# Altium schematic sheet 原理图.SchDoc
size A4; SheetNumber: 0; SheetTotal: 0
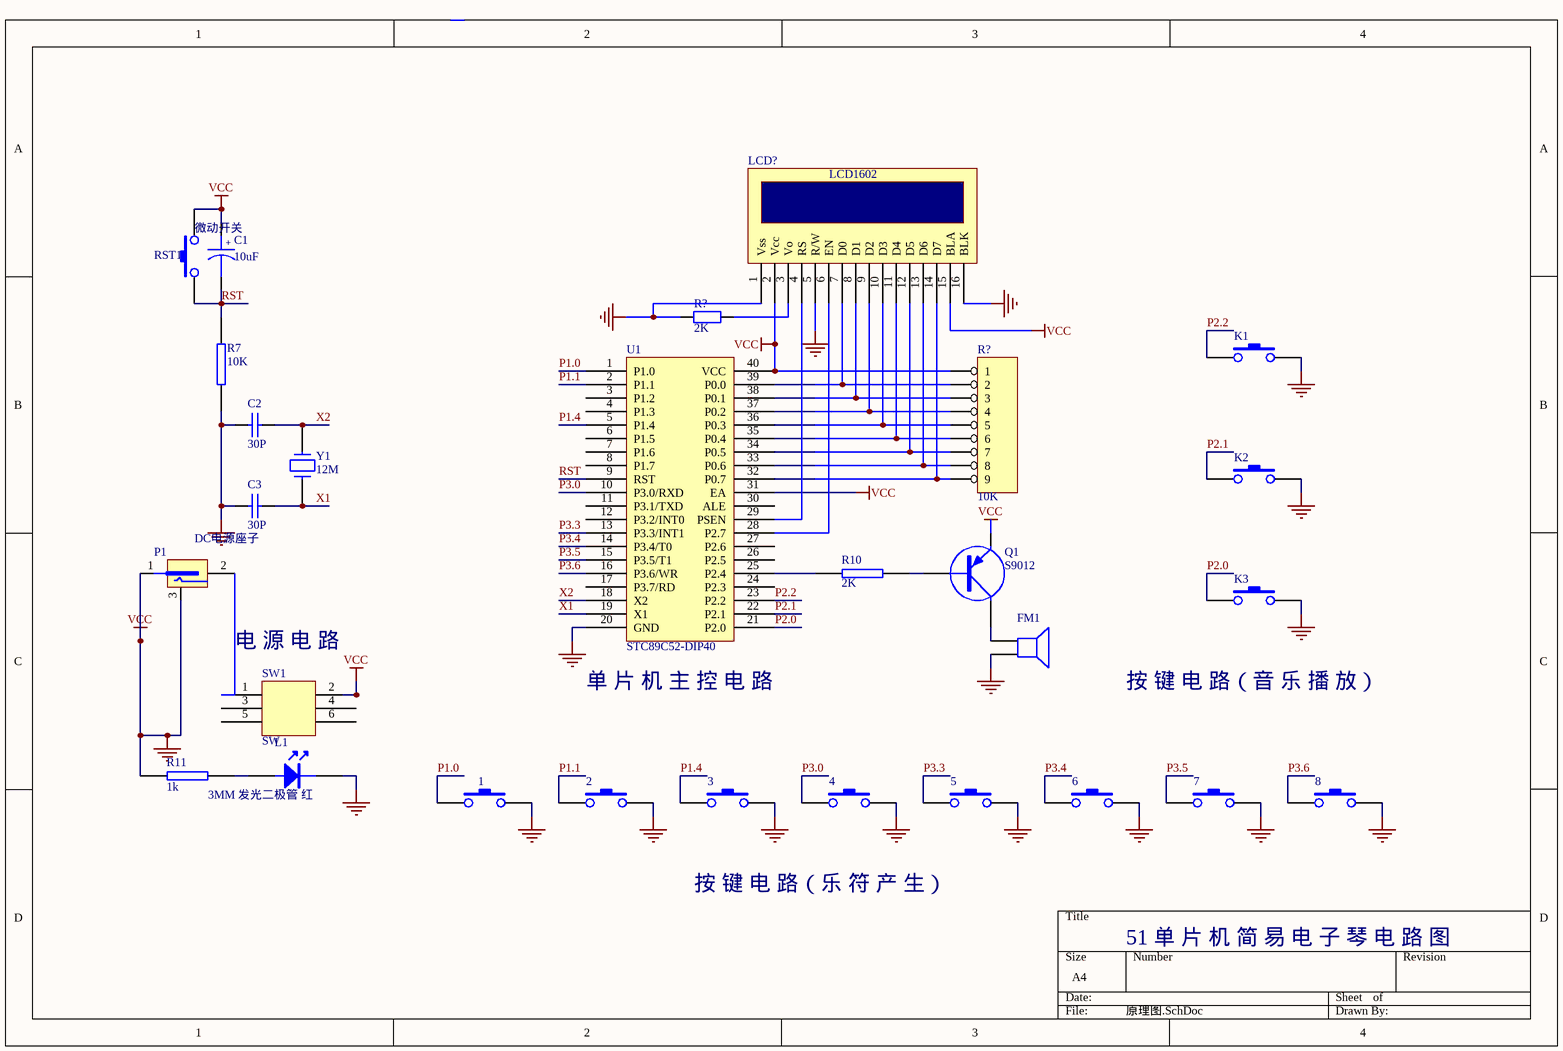
[diagram p0: 原理图.SchDoc]

## Parts
(Parts that share a designator on the sheet are numbered #1, #2 ... from top to bottom, then left to right.)
1  微动开关  [SW-PB]  (value not drawn)
2  微动开关  [SW-PB]  (value not drawn)
3  微动开关  [SW-PB]  (value not drawn)
4  微动开关  [SW-PB]  (value not drawn)
5  微动开关  [SW-PB]  (value not drawn)
6  微动开关  [SW-PB]  (value not drawn)
7  微动开关  [SW-PB]  (value not drawn)
8  微动开关  [SW-PB]  (value not drawn)
C1  10uF  [25V/4.7U]
C2  30P  [CAP-2.54]
C3  30P  [CAP-2.54]
FM1  SPEAKER  [BELL]  (value not drawn)
K1  微动开关  [SW-PB]  (value not drawn)
K2  微动开关  [SW-PB]  (value not drawn)
K3  微动开关  [SW-PB]  (value not drawn)
L1  3MM 发光二极管 红  [LED-3mm]
LCD?  LCD1602  [LCD1602]
P1  DC电源座子  [DC002]
Q1  S9012  [TO-92]
R7  10K  [AXIAL-0.4]
R10  2K  [AXIAL-0.4]
R11  1k  [AXIAL-0.4]
R?#1  2K  [AXIAL-0.4]
R?#2  10K  [SIP9]
RST1  微动开关  [SW-PB]
SW1  SW  [SW7X7]
U1  STC89C52-DIP40  [dip40]
Y1  12M  [XTAL]

## Nets
GND: 1.2 2.2 3.2 4.2 5.2 6.2 7.2 8.2 C1.1 C2.2 C3.2 FM1.2 K1.2 K2.2 K3.2 L1.2 LCD?.1(Vss) LCD?.2(Vcc) LCD?.5(R/W) LCD?.15(BLA) LCD?.16(BLK) P1.1 P1.3 Q1.2(E) R7.1 R11.1 R?#1.1 R?#2.1 RST1.2 SW1.2 U1.20(GND) U1.31(EA) U1.40(VCC)  [also labelled VCC]
P1.0: 1.1 U1.1(P1.0)
P1.1: 2.1 U1.2(P1.1)
P1.4: 3.1 U1.5(P1.4)
P2.0: K3.1 U1.21(P2.0)
P2.1: K2.1 U1.22(P2.1)
P2.2: K1.1 U1.23(P2.2)
P3.0: 4.1 U1.10(P3.0/RXD)
P3.3: 5.1 U1.13(P3.3/INT1)
P3.4: 6.1 U1.14(P3.4/T0)
P3.5: 7.1 U1.15(P3.5/T1)
P3.6: 8.1 U1.16(P3.6/WR)
RST: C1.2 R7.2 RST1.1 U1.9(RST)
X1: C3.1 U1.19(X1) Y1.1
X2: C2.1 U1.18(X2) Y1.2
NetFM1_1: FM1.1 Q1.3(C)
NetL1_1: L1.1 R11.2
NetLCD?_3: LCD?.3(Vo) R?#1.2
NetLCD?_4: LCD?.4(RS) U1.29(PSEN)
NetLCD?_6: LCD?.6(EN) U1.28(P2.7)
NetLCD?_7: LCD?.7(D0) R?#2.2 U1.39(P0.0)
NetLCD?_8: LCD?.8(D1) R?#2.3 U1.38(P0.1)
NetLCD?_9: LCD?.9(D2) R?#2.4 U1.37(P0.2)
NetLCD?_10: LCD?.10(D3) R?#2.5 U1.36(P0.3)
NetLCD?_11: LCD?.11(D4) R?#2.6 U1.35(P0.4)
NetLCD?_12: LCD?.12(D5) R?#2.7 U1.34(P0.5)
NetLCD?_13: LCD?.13(D6) R?#2.8 U1.33(P0.6)
NetLCD?_14: LCD?.14(D7) R?#2.9 U1.32(P0.7)
NetP1_2: P1.2 SW1.1
NetQ1_1: Q1.1(B) R10.2
NetR10_1: R10.1 U1.25(P2.4)

Not connected (* = marked no-connect by the designer): SW1 3 4 5 6; U1 3(P1.2) 4(P1.3) 6(P1.5) 7(P1.6) 8(P1.7) 11(P3.1/TXD) 12(P3.2/INT0) 17(P3.7/RD) 24(P2.3) 26(P2.5) 27(P2.6) 30(ALE)

## Notes on the sheet
- 电 源 电 路
- (near U1) 单 片 机 主 控 电 路
- 按 键 电 路（音 乐 播 放）
- 按 键 电 路（乐 符 产 生）
- 51 单 片 机 简 易 电 子 琴 电 路 图
- (in symbol CAPACITOR POL) +

## Library data of the parts
1-8 K1-K3 RST1 = SW-PB
C1 = CAPACITOR POL: 电容
C2 C3 = CAP: 电容
FM1 = SPEAKER: 无缘蜂鸣器
L1 = LED 3mm red
LCD? = 1602液晶: 液晶显示屏
Q1 = PNP: PNP 三极管
R7 R10 = RES2: 电阻
R11 = RES: 1/4电阻
R?#1 = Res2: 电阻; Published: 8-Jun-2000; LatestRevisionDate: 17-Jul-2002; LatestRevisionNote: Re-released for DXP Platform.; PackageReference: AXIAL-0.4; Publisher: Altium Limited; Value: 2k
R?#2 = HEADER 9: 排阻
SW1 = SW: 电源开关
U1 = STC89C52-DIP40: 51单片机
Y1 = CRYSTAL: 晶振